# Altium schematic sheet SCH-RP2350zero.schdoc
size 394 x 316 mm
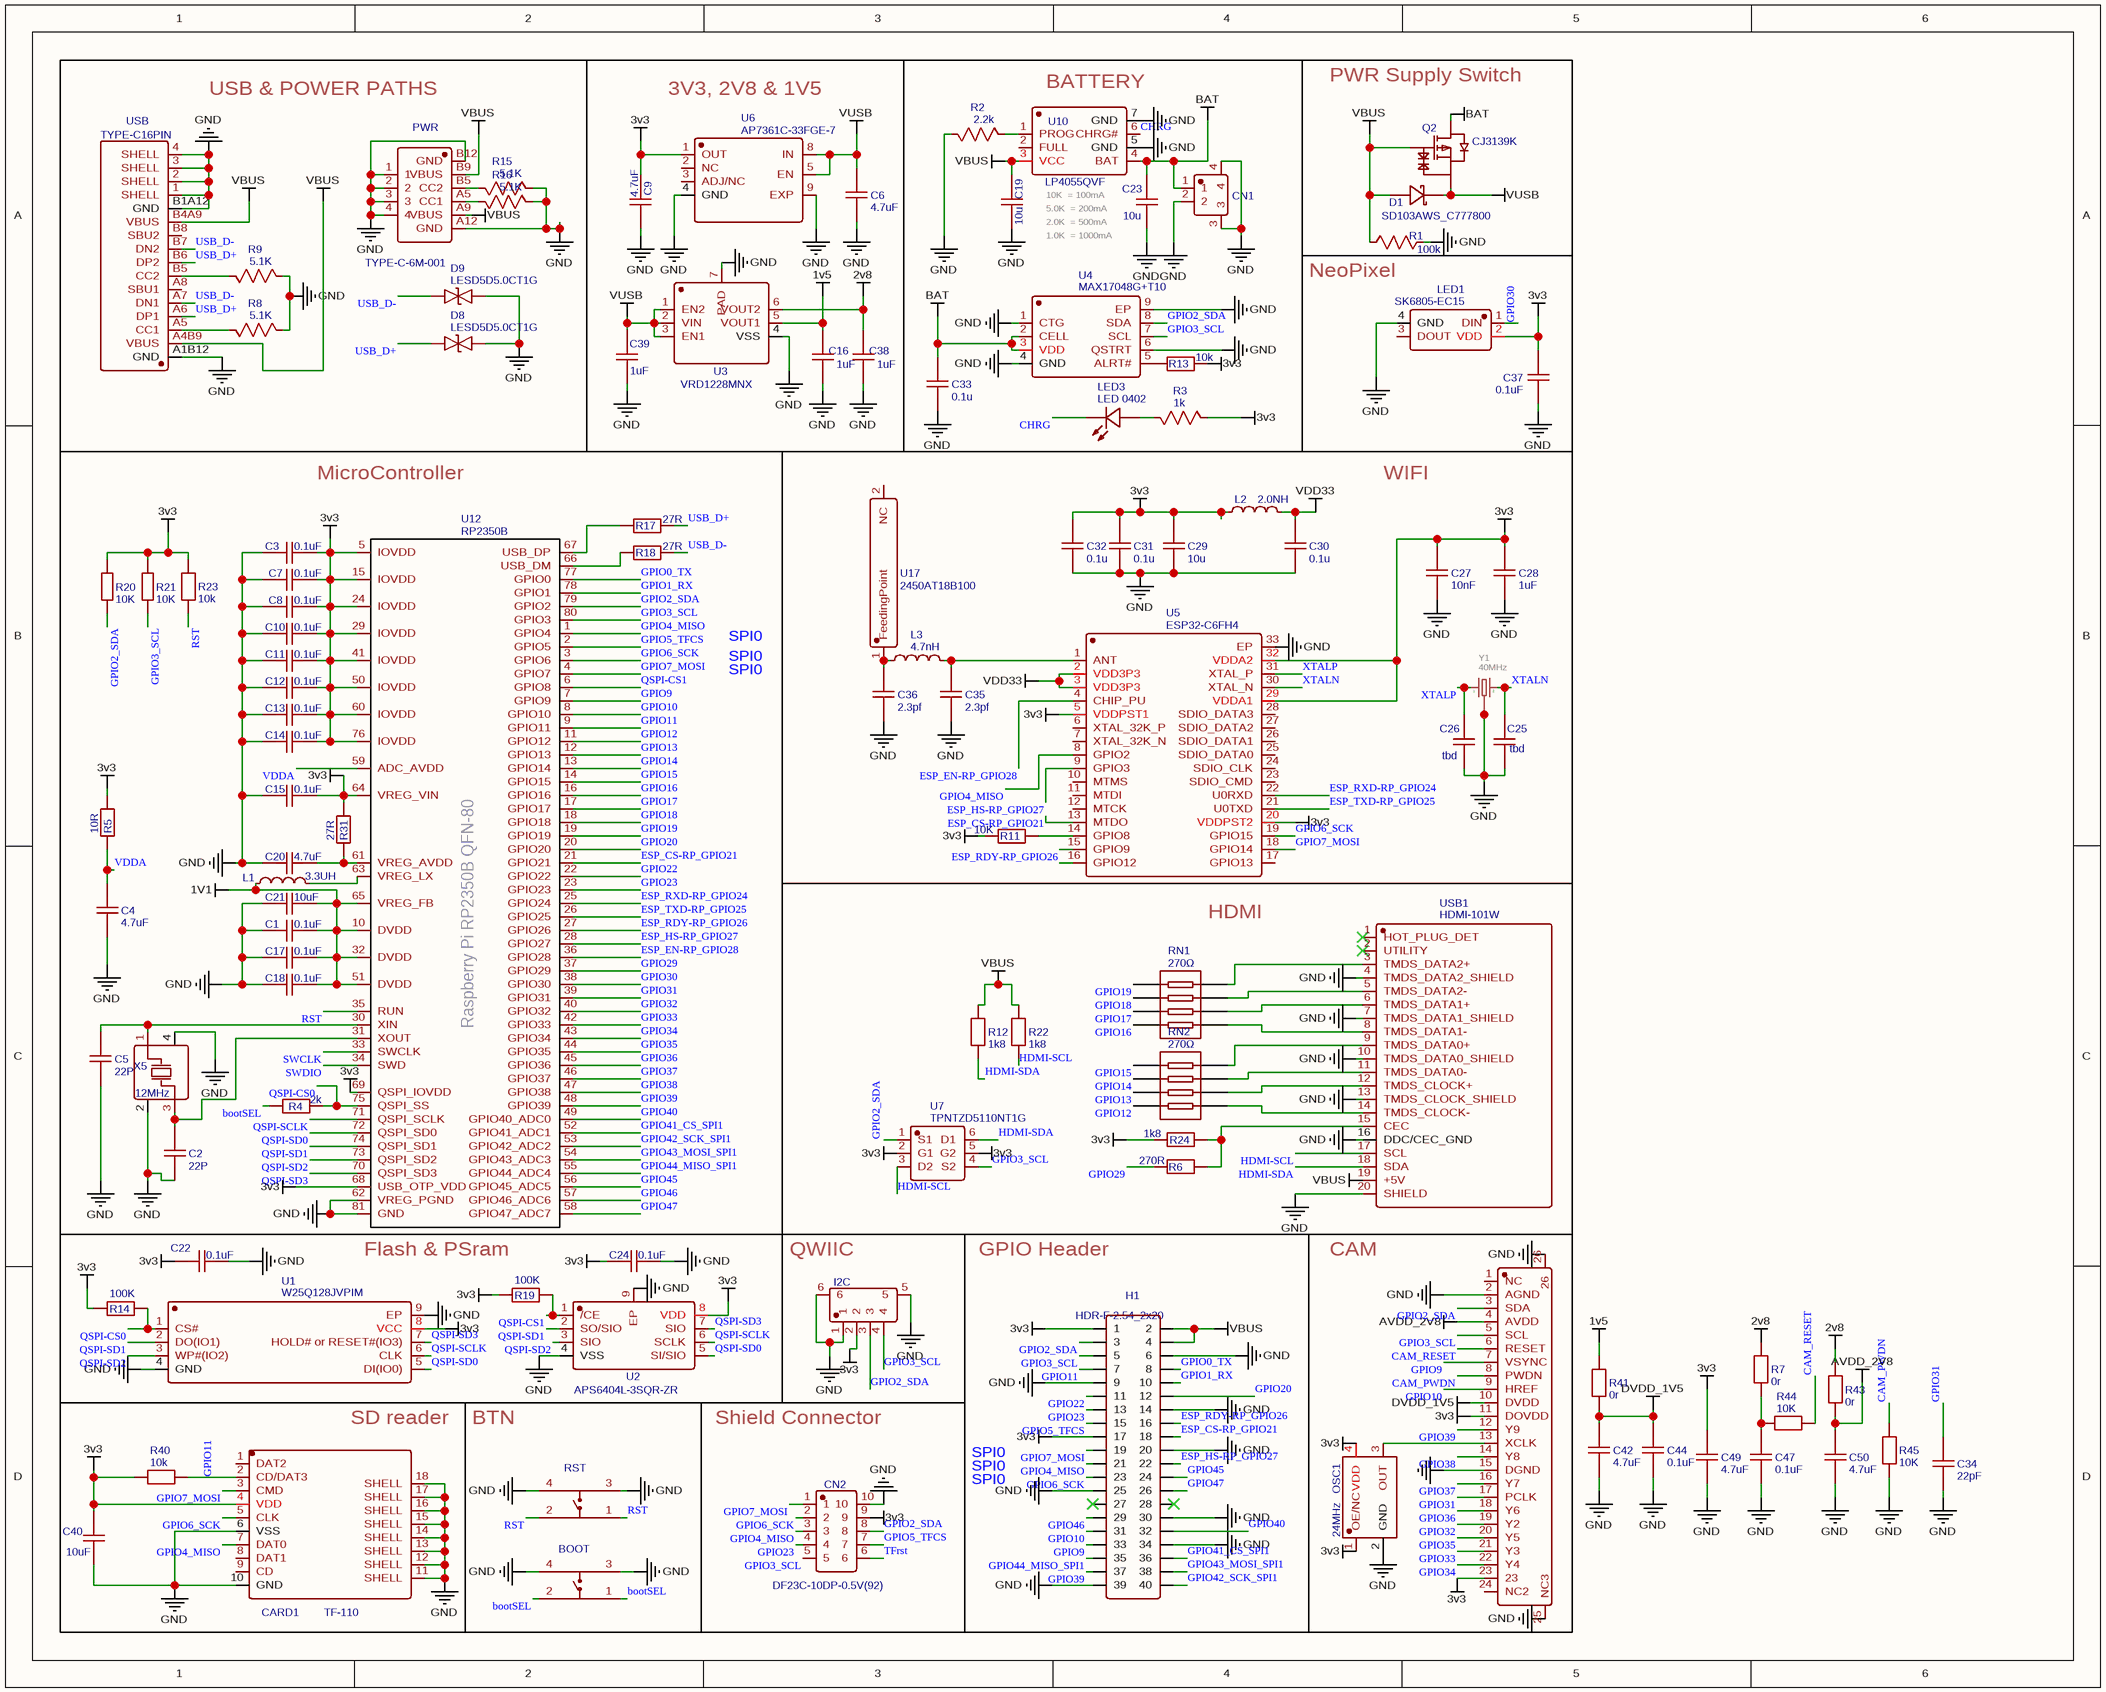
[diagram p0: SCH-RP2350zero.schdoc]

## Parts
BOOT  GT-TC034F-H018-L1  [SW-SMD_GT-TC034F-H018-L1]  (value not drawn)
C1  0.1uF  [C0402]
C2  22P  [C0402]
C3  0.1uF  [C0402]
C4  4.7uF  [C0402]
C5  22P  [C0402]
C6  4.7uF  [C0603]
C7  0.1uF  [C0402]
C8  0.1uF  [C0402]
C9  4.7uF  [C0603]
C10  0.1uF  [C0402]
C11  0.1uF  [C0402]
C12  0.1uF  [C0402]
C13  0.1uF  [C0402]
C14  0.1uF  [C0402]
C15  0.1uF  [C0402]
C16  1uF  [C0402]
C17  0.1uF  [C0402]
C18  0.1uF  [C0402]
C19  10u  [C0402]
C20  4.7uF  [C0402]
C21  10uF  [C0402]
C22  0.1uF  [C0402]
C23  10u  [C0402]
C24  0.1uF  [C0402]
C25  tbd  [C0402]
C26  tbd  [C0402]
C27  10nF  [C0402]
C28  1uF  [C0402]
C29  10u  [C0402]
C30  0.1u  [C0402]
C31  0.1u  [C0402]
C32  0.1u  [C0402]
C33  0.1u  [C0402]
C34  22pF  [C0402]
C35  2.3pf  [C0402]
C36  2.3pf  [C0402]
C37  0.1uF  [C0402]
C38  1uF  [C0402]
C39  1uF  [C0402]
C40  10uF  [C0402]
C42  4.7uF  [C0402]
C44  0.1uF  [C0402]
C47  0.1uF  [C0402]
C49  4.7uF  [C0402]
C50  4.7uF  [C0402]
CAMERA1  FPC0.5-24P  [FPC-SMD_P0.50-24P_XJ-FGS]  (value not drawn)
CARD1  TF-110  [TF-SMD_TF-110]
CN1  WF08002-01205  [CONN-SMD_WF08002-01205]  (value not drawn)
CN2  DF23C-10DP-0.5V(92)  [CONN-SMD_DF23C-10DP-0.5V92]
D1  SD103AWS_C777800  [SOD-323_L1.8-W1.3-LS2.5-FD]
D8  LESD5D5.0CT1G  [SOD-523_L1.2-W0.8-LS1.6-BI]
D9  LESD5D5.0CT1G  [SOD-523_L1.2-W0.8-LS1.6-BI]
H1  HDR-F-2.54_2x20  [HDR-F-2.54_2X20]
I2C  WF10004-01200  [CONN-SMD_4P-P1.00_WF10004-01200]  (value not drawn)
L1  3.3UH  [L0603]
L2  2.0NH  [L0402]
L3  4.7nH  [L0402]
LED1  SK6805-EC15  [LED-SMD_4P-L1.5-W1.5-BL]
LED3  LED 0402  [LED_0402]
OSC1  24MHz  [OSC-SMD_4P-L1.6-W1.2-BL]
PWR  TYPE-C-6M-001  [USB-C-SMD_918-418K2023S40006]
Q2  CJ3139K  [SOT-723_L1.2-W0.8-P0.40-LS1.2-BR]
R1  100k  [R0402]
R2  2.2k  [R0402]
R3  1k  [R0402]
R4  2k  [R0402]
R5  10R  [R0402]
R6  270R  [R0402]
R7  0r  [R0402]
R8  5.1K  [R0402]
R9  5.1K  [R0402]
R11  10K  [R0402]
R12  1k8  [R0402]
R13  10k  [R0402]
R14  100K  [R0402]
R15  5.1K  [R0402]
R16  5.1K  [R0402]
R17  27R  [R0402]
R18  27R  [R0402]
R19  100K  [R0402]
R20  10K  [R0402]
R21  10K  [R0402]
R22  1k8  [R0402]
R23  10k  [R0402]
R24  1k8  [R0402]
R31  27R  [R0402]
R40  10k  [R0402]
R41  0r  [R0402]
R43  0r  [R0402]
R44  10K  [R0402]
R45  10K  [R0402]
RN1  270Ω  [RES-ARRAY-SMD_0804-8P-L2.0-W1.0-BL]
RN2  270Ω  [RES-ARRAY-SMD_0804-8P-L2.0-W1.0-BL]
RST  GT-TC034F-H018-L1  [SW-SMD_GT-TC034F-H018-L1]  (value not drawn)
U1  W25Q128JVPIM  [WSON-8_L5.0-W6.0-P1.27-BL-EP]
U2  APS6404L-3SQR-ZR  [USON-8_L3.0-W2.0-P0.50-BL-EP]
U3  VRD1228MNX  [SON-6_L1.8-W1.8-P0.50-LS2.0-BL]
U4  MAX17048G+T10  [DFN-8_L2.0-W2.0-P0.50-BL-EP]
U5  ESP32-C6FH4  [QFN-32_L5.0-W5.0-P0.50-TL-EP3.4]
U6  AP7361C-33FGE-7  [DFN-8_L3.0-W3.0-P0.65-BL-EP]
U7  TPNTZD5110NT1G  [SOT-563-6_L1.6-W1.2-P0.5-LS1.6-BR]
U10  LP4055QVF  [TDFN-6_L2.0-W2.0-P0.65-TL-EP]
U12  RP2350B  [RP2350B_QFN-80]
U17  2450AT18B100  [ANT-SMD_L3.2-W1.6]
USB  TYPE-C16PIN  [USB-C-SMD_TYPE-C16PIN]
USB1  HDMI-101W  [HDMI-SMD_HDMI-101W]
X5  12MHz  [OSC-SMD_4P-L2.0-W1.6-BL_R2016XXXXMD4GI]
Y1  40MHz  [OSC-SMD_4P-L2.0-W1.6-BL]

## Nets
1V1: C1.2 C17.2 C18.2 C21.2 L1.1 U12.10(DVDD) U12.32(DVDD) U12.51(DVDD) U12.65(VREG_FB)
1v5: C16.2 R41.1 U3.5(VOUT1)
2v8: C38.2 R7.1 R43.1 U3.6(VOUT2)
3v3: C3.2 C7.2 C8.2 C9.2 C10.2 C11.2 C12.2 C13.2 C14.2 C15.2 C22.1 C24.1 C27.2 C28.2 C29.1 C31.1 C32.1 C37.1 C40.1 C49.1 CAMERA1.11(DOVDD) CAMERA1.23 CARD1.4(VDD) CN2.9 H1.1 H1.17 I2C.2 L2.1 LED1.2(VDD) OSC1.1(OE/NC) OSC1.4(VDD) R3.2 R5.2 R11.1 R13.2 R14.1 R19.1 R20.1 R21.1 R23.1 R24.2 R31.2 R40.2 U1.8(VCC) U2.8(VDD) U5.5(VDDPST1) U5.20(VDDPST2) U5.29(VDDA1) U5.32(VDDA2) U6.1(OUT) U7.2(G1) U7.5(G2) U12.5(IOVDD) U12.15(IOVDD) U12.24(IOVDD) U12.29(IOVDD) U12.41(IOVDD) U12.50(IOVDD) U12.60(IOVDD) U12.64(VREG_VIN) U12.68(USB_OTP_VDD) U12.69(QSPI_IOVDD) U12.76(IOVDD)
AVDD_2V8: C50.1 CAMERA1.4(AVDD) R43.2
BAT: C23.1 C33.2 CN1.1 Q2.3(D) U4.2(CELL) U4.3(VDD) U10.4(BAT)
DVDD_1V5: C42.1 C44.1 CAMERA1.10(DVDD) R41.2
GND: BOOT.3 BOOT.4 C1.1 C2.2 C3.1 C4.1 C5.2 C6.2 C7.1 C8.1 C9.1 C10.1 C11.1 C12.1 C13.1 C14.1 C15.1 C16.1 C17.1 C18.1 C19.2 C20.1 C21.1 C22.2 C23.2 C24.2 C25.2 C26.2 C27.1 C28.1 C29.2 C30.2 C31.2 C32.2 C33.1 C34.2 C35.1 C36.1 C37.2 C38.1 C39.1 C40.2 C42.2 C44.2 C47.2 C49.2 C50.2 CAMERA1.2(AGND) CAMERA1.15(DGND) CAMERA1.25(NC3) CAMERA1.26 CARD1.6(VSS) CARD1.10(GND) CARD1.11(SHELL) CARD1.12(SHELL) CARD1.13(SHELL) CARD1.14(SHELL) CARD1.15(SHELL) CARD1.16(SHELL) CARD1.17(SHELL) CARD1.18(SHELL) CN1.2 CN1.3 CN1.4 CN2.10 D8.2 D9.2 H1.6 H1.9 H1.14 H1.20 H1.25 H1.30 H1.34 H1.39 I2C.1 I2C.5 I2C.6 LED1.4(GND) OSC1.2(GND) PWR.1 PWR.2 PWR.3 PWR.4 PWR.A12(GND) PWR.B12(GND) R1.1 R2.2 R8.1 R9.1 R15.1 R16.1 R45.1 RST.3 RST.4 U1.4(GND) U1.9(EP) U2.4(VSS) U2.9(EP) U3.4(VSS) U3.7(PAD) U4.1(CTG) U4.4(GND) U4.6(QSTRT) U4.9(EP) U5.33(EP) U6.4(GND) U6.9(EXP) U10.5(GND) U10.7(GND) U12.62(VREG_PGND) U12.81(GND) USB.1(SHELL) USB.2(SHELL) USB.3(SHELL) USB.4(SHELL) USB.A1B12(GND) USB.B1A12(GND) USB1.4(TMDS_DATA2_SHIELD) USB1.7(TMDS_DATA1_SHIELD) USB1.10(TMDS_DATA0_SHIELD) USB1.13(TMDS_CLOCK_SHIELD) USB1.16(DDC/CEC_GND) USB1.20(SHIELD) X5.2(GND/Lid) X5.4(GND/Lid) Y1.2(GND) Y1.4(GND)
VBUS: C19.1 D1.1(A) H1.2 H1.4 PWR.A9(VBUS) PWR.B9(VBUS) Q2.1(G) R1.2 R12.1 R22.1 U10.3(VCC) USB.A4B9(VBUS) USB.B4A9(VBUS) USB1.19(+5V)
VDD33: C30.1 L2.2 U5.2(VDD3P3) U5.3(VDD3P3)
VUSB: C6.1 C39.2 D1.2(K) Q2.2(S) U3.1(EN2) U3.2(VIN) U3.3(EN1) U6.5(EN) U6.8(IN)
bootSEL: BOOT.1 BOOT.2 R4.1
CAM_PWDN: CAMERA1.8(PWDN) R45.2
CAM_RESET: CAMERA1.6(RESET) R44.1
CHRG: LED3.2(K) U10.6(CHRG#)
ESP_CS-RP_GPIO21: H1.18 U5.13(MTDO) U12.21(GPIO21)
ESP_EN-RP_GPIO28: U5.4(CHIP_PU) U12.36(GPIO28)
ESP_HS-RP_GPIO27: H1.22 U5.9(GPIO3) U12.28(GPIO27)
ESP_RDY-RP_GPIO26: H1.16 U5.15(GPIO9) U12.27(GPIO26)
ESP_RXD-RP_GPIO24: U5.22(U0RXD) U12.25(GPIO24)
ESP_TXD-RP_GPIO25: U5.21(U0TXD) U12.26(GPIO25)
GPIO0_TX: H1.8 U12.77(GPIO0)
GPIO1_RX: H1.10 U12.78(GPIO1)
GPIO2_SDA: CAMERA1.3(SDA) CN2.8 H1.3 I2C.3 R20.2 U4.8(SDA) U7.1(S1) U12.79(GPIO2)
GPIO3_SCL: CAMERA1.5(SCL) CN2.5 H1.5 I2C.4 R21.2 U4.7(SCL) U7.4(S2) U12.80(GPIO3)
GPIO4_MISO: CARD1.7(DAT0) CN2.3 H1.21 U5.8(GPIO2) U12.1(GPIO4)
GPIO5_TFCS: CN2.7 H1.15 U12.2(GPIO5)
GPIO6_SCK: CARD1.5(CLK) CN2.2 H1.23 U5.19(GPIO15) U12.3(GPIO6)
GPIO7_MOSI: CARD1.3(CMD) CN2.1 H1.19 U5.18(GPIO14) U12.4(GPIO7)
GPIO9: CAMERA1.7(VSYNC) H1.33 U12.7(GPIO9)
GPIO10: CAMERA1.9(HREF) H1.31 U12.8(GPIO10)
GPIO11: CARD1.2(CD/DAT3) H1.7 R40.1 U12.9(GPIO11)
GPIO12: RN2.8 U12.11(GPIO12)
GPIO13: RN2.7 U12.12(GPIO13)
GPIO14: RN2.6 U12.13(GPIO14)
GPIO15: RN2.5 U12.14(GPIO15)
GPIO16: RN1.8 U12.16(GPIO16)
GPIO17: RN1.7 U12.17(GPIO17)
GPIO18: RN1.6 U12.18(GPIO18)
GPIO19: RN1.5 U12.19(GPIO19)
GPIO20: H1.12 U12.20(GPIO20)
GPIO22: H1.11 U12.22(GPIO22)
GPIO23: CN2.4 H1.13 U12.23(GPIO23)
GPIO29: R6.1 U12.37(GPIO29)
GPIO30: LED1.1(DIN) U12.38(GPIO30)
GPIO31: C34.1 CAMERA1.17(PCLK) U12.39(GPIO31)
GPIO32: CAMERA1.19(Y2) U12.40(GPIO32)
GPIO33: CAMERA1.21(Y3) U12.42(GPIO33)
GPIO34: CAMERA1.22(Y4) U12.43(GPIO34)
GPIO35: CAMERA1.20(Y5) U12.44(GPIO35)
GPIO36: CAMERA1.18(Y6) U12.45(GPIO36)
GPIO37: CAMERA1.16(Y7) U12.46(GPIO37)
GPIO38: CAMERA1.14(Y8) U12.47(GPIO38)
GPIO39: CAMERA1.12(Y9) H1.37 U12.48(GPIO39)
GPIO40: H1.32 U12.49(GPIO40_ADC0)
GPIO41_CS_SPI1: H1.36 U12.52(GPIO41_ADC1)
GPIO42_SCK_SPI1: H1.40 U12.53(GPIO42_ADC2)
GPIO43_MOSI_SPI1: H1.38 U12.54(GPIO43_ADC3)
GPIO44_MISO_SPI1: H1.35 U12.55(GPIO44_ADC4)
GPIO45: H1.24 U12.56(GPIO45_ADC5)
GPIO46: H1.29 U12.57(GPIO46_ADC6)
GPIO47: H1.26 U12.58(GPIO47_ADC7)
HDMI-SCL: R22.2 U7.3(D2) USB1.17(SCL)
HDMI-SDA: R12.2 U7.6(D1) USB1.18(SDA)
QSPI-CS0: R4.2 R14.2 U1.1(CS#) U12.75(QSPI_SS)
QSPI-CS1: R19.2 U2.1(/CE) U12.6(GPIO8)
QSPI-SCLK: U1.6(CLK) U2.6(SCLK) U12.71(QSPI_SCLK)
QSPI-SD0: U1.5(DI(IO0)) U2.5(SI/SIO) U12.72(QSPI_SD0)
QSPI-SD1: U1.2(DO(IO1)) U2.2(SO/SIO) U12.74(QSPI_SD1)
QSPI-SD2: U1.3(WP#(IO2)) U2.3(SIO) U12.73(QSPI_SD2)
QSPI-SD3: U1.7(HOLD#_or_RESET#(IO3)) U2.7(SIO) U12.70(QSPI_SD3)
RST: R23.2 RST.1 RST.2 U12.35(RUN)
SWCLK: U12.33(SWCLK)
SWDIO: U12.34(SWD)
TFrst: CN2.6
USB_D+: D8.1 R17.2 USB.A6(DP1) USB.B6(DP2)
USB_D-: D9.1 R18.2 USB.A7(DN1) USB.B7(DN2)
VDDA: C4.2 R5.1 U12.59(ADC_AVDD)
XTALN: C25.1 U5.30(XTAL_N) Y1.3
XTALP: C26.1 U5.31(XTAL_P) Y1.1
NetC2_1: C2.1 U12.31(XOUT) X5.3(OSC2)
NetC5_1: C5.1 U12.30(XIN) X5.1(OSC1)
NetC20_2: C20.2 R31.1 U12.61(VREG_AVDD)
NetC35_2: C35.2 L3.2 U5.1(ANT)
NetC36_2: C36.2 L3.1 U17.1(FeedingPoint)
NetC47_1: C47.1 R7.2 R44.2
NetCAMERA1_13: CAMERA1.13(XCLK) OSC1.3(OUT)
NetL1_2: L1.2 U12.63(VREG_LX)
NetLED3_1: LED3.1(A) R3.1
NetPWR_A5: PWR.A5(CC1) R16.2
NetPWR_B5: PWR.B5(CC2) R15.2
NetR2_1: R2.1 U10.1(PROG)
NetR6_2: R6.2 R24.1 USB1.15(CEC)
NetR8_2: R8.2 USB.A5(CC1)
NetR9_2: R9.2 USB.B5(CC2)
NetR11_2: R11.2 U5.14(GPIO8)
NetR13_1: R13.1 U4.5(ALRT#)
NetR17_1: R17.1 U12.67(USB_DP)
NetR18_1: R18.1 U12.66(USB_DM)
NetRN1_1: RN1.1 USB1.8(TMDS_DATA1-)
NetRN1_2: RN1.2 USB1.6(TMDS_DATA1+)
NetRN1_3: RN1.3 USB1.5(TMDS_DATA2-)
NetRN1_4: RN1.4 USB1.3(TMDS_DATA2+)
NetRN2_1: RN2.1 USB1.14(TMDS_CLOCK-)
NetRN2_2: RN2.2 USB1.12(TMDS_CLOCK+)
NetRN2_3: RN2.3 USB1.11(TMDS_DATA0-)
NetRN2_4: RN2.4 USB1.9(TMDS_DATA0+)

Not connected (* = marked no-connect by the designer): CAMERA1 1(NC) 24(NC2); CARD1 1(DAT2) 8(DAT1) 9(CD); H1 27* 28*; LED1 3(DOUT); U5 6(XTAL_32K_P) 7(XTAL_32K_N) 10(MTMS) 11(MTDI) 12(MTCK) 16(GPIO12) 17(GPIO13) 23(SDIO_CMD) 24(SDIO_CLK) 25(SDIO_DATA0) 26(SDIO_DATA1) 27(SDIO_DATA2) 28(SDIO_DATA3); U6 2(NC) 3(ADJ/NC); U10 2(FULL); U17 2(NC); USB A8(SBU1) B8(SBU2); USB1 1(HOT_PLUG_DET)* 2(UTILITY)*

## Notes on the sheet
- USB & POWER PATHS
- 3V3, 2V8 & 1V5
- (near U10) BATTERY
- (near Q2) PWR Supply Switch
- 2.0K  = 500mA
- 5.0K  = 200mA
- 10K  = 100mA
- 1.0K  = 1000mA
- (near R1) NeoPixel
- MicroController
- WIFI
- SPI0
- HDMI
- Flash & PSram
- (near I2C) QWIIC
- GPIO Header
- (near USB1) CAM
- SD reader
- BTN
- Shield Connector
- (in symbol RP2350B) Raspberry Pi RP2350B QFN-80

## Library data of the parts
BOOT RST = GT-TC034F-H018-L1: Manufacturer: G-Switch(品赞); Contributor: LCSC; Supplier: LCSC; Supplier Part: C2835023; Manufacturer Part: GT-TC034F-H018-L1; spicePre: S; spiceSymbolName: GT-TC034F-H018-L1
C1 C3 C7 C8 C10-C15 C17 C18 C22 C24 C37 C44 C47 = 0.1uF: nameAlias: Value(F); Contributor: LCEDA_Lib; spicePre: C; spiceSymbolName: C_0805_US
C2 C5 = 22P: nameAlias: Value(F); Contributor: LCEDA_Lib; spicePre: C; spiceSymbolName: C_0805_US
C4 C6 C9 C20 C42 C49 C50 = 4.7uF: nameAlias: Value(F); Contributor: LCEDA_Lib; spicePre: C
  C4 C20 C42 C49 C50: spiceSymbolName: C_0805_US
  C6 C9: spiceSymbolName: C_0603_US
C16 C28 C38 C39 = 1uF: nameAlias: Value(F); Contributor: LCEDA_Lib; spicePre: C; spiceSymbolName: C_0805_US
C19 C23 C29 = 10u: nameAlias: Value(F); Contributor: LCEDA_Lib; spicePre: C; spiceSymbolName: C_0805_US
C21 C40 = 10uF: nameAlias: Value(F); Contributor: LCEDA_Lib; spicePre: C; spiceSymbolName: C_0805_US
C25 C26 = tbd: nameAlias: Value(F); Contributor: LCEDA_Lib; spicePre: C; spiceSymbolName: C_0805_US
C27 = 10nF: nameAlias: Value(F); Contributor: LCEDA_Lib; spicePre: C; spiceSymbolName: C_0805_US
C30-C33 = 0.1u: nameAlias: Value(F); Contributor: LCEDA_Lib; spicePre: C; spiceSymbolName: C_0805_US
C34 = 22pF: nameAlias: Value(F); Contributor: LCEDA_Lib; spicePre: C; spiceSymbolName: C_0805_US
C35 C36 = 2.3pf: nameAlias: Value(F); Contributor: LCEDA_Lib; spicePre: C; spiceSymbolName: C_0805_US
CAMERA1 = FPC0.5-24P: Manufacturer: Shenzhen Cankemeng; Contributor: LCSC; Supplier: LCSC; Supplier Part: C132514; Manufacturer Part: -; JLCPCB Part Class: Extended Part; spicePre: F; spiceSymbolName: FPC0.5-24P
CARD1 = TF-110: Manufacturer: XUNPU; Contributor: LCSC; Supplier: LCSC; Supplier Part: C266613; Manufacturer Part: TF-110; JLCPCB Part Class: Extended Part; spicePre: C; spiceSymbolName: TF-110
CN1 = WF08002-01205: Manufacturer: SHENZHEN ATOM TECH; Contributor: LCSC; Supplier: LCSC; Supplier Part: C545257; Manufacturer Part: WF08002-01205; JLCPCB Part Class: Extended Part; spicePre: C; spiceSymbolName: WF08002-01205
CN2 = DF23C-10DP-0.5V(92): Manufacturer: HRS(广濑); Contributor: LCSC; Supplier: LCSC; Supplier Part: C530956; Manufacturer Part: DF23C-10DP-0.5V(92); JLCPCB Part Class: Extended Part; spicePre: C; spiceSymbolName: DF23C-10DP-0.5V(92)
D1 = SD103AWS_C777800: Manufacturer: HT(Shenzhen Jinyu Semicon); Contributor: LCSC; Supplier: LCSC; Supplier Part: C777800; Manufacturer Part: SD103AWS; JLCPCB Part Class: Extended Part; spicePre: D; spiceSymbolName: SD103AWS_C777800
D8 D9 = LESD5D5.0CT1G: Manufacturer: Leshan Radio; Contributor: LCSC; Supplier: LCSC; Supplier Part: C383211; Manufacturer Part: LESD5D5.0CT1G; JLCPCB Part Class: Extended Part; spicePre: D; spiceSymbolName: LESD5D5.0CT1G
H1 = HDR-F-2.54_2x20: Contributor: LCEDA_Lib; Supplier Part: C50982; Supplier: LCSC; spicePre: H; spiceSymbolName: HDR-F-2.54_2x20
I2C = WF10004-01200: Manufacturer: ATOM(爱特姆); Contributor: LCSC; Supplier: LCSC; Supplier Part: C479990; Manufacturer Part: WF10004-01200; JLCPCB Part Class: Extended Part; spicePre: C; spiceSymbolName: WF10004-01200
L1 = 3.3UH: nameAlias: Value(H); Contributor: LCEDA_Lib; spicePre: L; spiceSymbolName: L0603_US
L2 = 2.0NH: nameAlias: Value(H); Contributor: LCEDA_Lib; spicePre: L; spiceSymbolName: L0402_US
L3 = 4.7nH: nameAlias: Value(H); Contributor: LCEDA_Lib; spicePre: L; spiceSymbolName: L0402_US
LED1 = SK6805-EC15: Manufacturer: 欧思科光电; Contributor: LCSC; Supplier: LCSC; Supplier Part: C2890035; Manufacturer Part: SK6805-EC15; JLCPCB Part Class: Extended Part; spicePre: L; spiceSymbolName: SK6805-EC15
LED3 = LED 0402: Manufacturer: ROHM Semicon; Manufacturer Part: SML-P12YTT86Q; Contributor: LCSC; Supplier: LCSC; Supplier Part: C123071; spicePre: L; spiceSymbolName: LED 0402
OSC1 = 24MHz: Manufacturer: YXC(扬兴晶振); Manufacturer Part: OT4EL89CJI-111YLC-24M; nameAlias: Value; Contributor: lcsc; Supplier: LCSC; Supplier Part: C19078199; JLCPCB Part Class: Extended Part; spicePre: O; spiceSymbolName: OT4EL89CJI-111YLC-24M
PWR = TYPE-C-6M-001: Manufacturer: USAKRO(美韩); Contributor: LCSC; Supplier: LCSC; Supplier Part: C2798175; Manufacturer Part: TYPE-C-6M-001; JLCPCB Part Class: Extended Part; spicePre: U; spiceSymbolName: TYPE-C-6M-001
Q2 = CJ3139K: Manufacturer: CJ; SMT Type: Extend; Paste Type: expand; Supplier: LCSC; Manufacturer Part: CJ3139K; image: //image.lceda.cn/szlcsc/C70022.jpg; Supplier Part: C70022; JLCPCB SMD: Yes; Assembly Type: smtWeld; spicePre: Q; spiceSymbolName: CJ3139K
R1 = 100k: nameAlias: Value(Ω); Contributor: LCEDA_Lib; spicePre: R; spiceSymbolName: R_0805_US
R2 = 2.2k: nameAlias: Value(Ω); Contributor: LCEDA_Lib; spicePre: R; spiceSymbolName: R_0603_US
R3 = 1k: nameAlias: Value(Ω); Contributor: LCEDA_Lib; spicePre: R; spiceSymbolName: R_0603_US
R4 = 2k: nameAlias: Value(Ω); Contributor: LCEDA_Lib; spicePre: R; spiceSymbolName: R_0402_EU
R5 = 10R: nameAlias: Value(Ω); Contributor: LCEDA_Lib; spicePre: R; spiceSymbolName: R_0603_EU
R6 = 270R: nameAlias: Value(Ω); Contributor: LCEDA_Lib; spicePre: R; spiceSymbolName: R_0603_EU
R7 R41 R43 = 0r: nameAlias: Value(Ω); Contributor: LCEDA_Lib; spicePre: R; spiceSymbolName: R_0402_EU
R8 R9 R15 R16 = 5.1K: nameAlias: Value(Ω); Contributor: LCEDA_Lib; spicePre: R; spiceSymbolName: R_0603_US
R11 R44 R45 = 10K: nameAlias: Value(Ω); Contributor: LCEDA_Lib; spicePre: R
  R11: spiceSymbolName: R_0603_EU
  R44 R45: spiceSymbolName: R_0402_EU
R12 R22 R24 = 1k8: nameAlias: Value(Ω); Contributor: LCEDA_Lib; spicePre: R; spiceSymbolName: R_0603_EU
R13 R23 R40 = 10k: nameAlias: Value(Ω); Contributor: LCEDA_Lib; spicePre: R
  R13: spiceSymbolName: R_0603_EU
  R23 R40: spiceSymbolName: R_0402_EU
R14 R19 = 100K: nameAlias: Value(Ω); Contributor: LCEDA_Lib; spicePre: R; spiceSymbolName: R_0402_EU
R17 R18 R31 = 27R: nameAlias: Value(Ω); Contributor: LCEDA_Lib; spicePre: R; spiceSymbolName: R_0603_EU
R20 R21 = 10K: Manufacturer: YAGEO; Manufacturer Part: RC0603FR-0739KL; nameAlias: Resistance (Ohms); Contributor: LCSC; Supplier: LCSC; Supplier Part: C163424; spicePre: R; spiceSymbolName: RC0603FR-0739KL
RN1 RN2 = 270Ω: Manufacturer: BOURNS; Manufacturer Part: CAT10-271J4LF; nameAlias: Value; Contributor: LCSC; Supplier: LCSC; Supplier Part: C148510; JLCPCB Part Class: Extended Part; spicePre: R; spiceSymbolName: CAT10-271J4LF
U1 = W25Q128JVPIM: Manufacturer: WINBOND(华邦); Contributor: LCSC; Supplier: LCSC; Supplier Part: C2641199; Manufacturer Part: W25Q128JVPIM; spicePre: U; spiceSymbolName: W25Q128JVPIM
U2 = APS6404L-3SQR-ZR: Manufacturer: Apmemory; Contributor: lcsc; Supplier: LCSC; Supplier Part: C3040877; Manufacturer Part: APS6404L-3SQR-ZR; JLCPCB Part Class: Extended Part; spicePre: U; spiceSymbolName: APS6404L-3SQR-ZR
U3 = VRD1228MNX: Manufacturer: AnaSem; Contributor: LCSC; Supplier: LCSC; Supplier Part: C697900; Manufacturer Part: VRD1228MNX; JLCPCB Part Class: Extended Part; spicePre: U; spiceSymbolName: VRD1228MNX
U4 = MAX17048G+T10: Manufacturer: ADI(亚德诺)/MAXIM(美信); Contributor: LCSC; Supplier: LCSC; Supplier Part: C2682616; Manufacturer Part: MAX17048G+T10; JLCPCB Part Class: Extended Part; spicePre: U; spiceSymbolName: MAX17048G+T10
U5 = ESP32-C6FH4: Manufacturer: null; Contributor: lcsc; Supplier: LCSC; Supplier Part: C9900054998; Manufacturer Part: ESP32-C6FH4; spicePre: U; spiceSymbolName: ESP32-C6FH4
U6 = AP7361C-33FGE-7: Manufacturer: DIODES; Contributor: Hany_elkomy; SMT Type: Extend; Paste Type: expand; Supplier: LCSC; Manufacturer Part: AP7361C-33FGE-7; Supplier Part: C151007; JLCPCB SMD: Yes; LCSC Assembly: Yes; Assembly Type: smtWeld; spicePre: U; spiceSymbolName: AP7361C-33FGE-7
U7 = TPNTZD5110NT1G: Manufacturer: TECH PUBLIC(台舟); Contributor: lcsc; Supplier: LCSC; Supplier Part: C5310957; Manufacturer Part: TPNTZD5110NT1G; JLCPCB Part Class: Extended Part; spicePre: U; spiceSymbolName: TPNTZD5110NT1G
U10 = LP4055QVF: Manufacturer: LOWPOWER; Contributor: LCSC; SMT Type: Extend; Supplier: LCSC; Supplier Part: C387714; Manufacturer Part: LP4055QVF; LCSC Assembly: Yes; spicePre: U; spiceSymbolName: LP4055QVF
U12 = RP2350B: Manufacturer: Raspberry Pi; Contributor: Hany_elkomy; Manufacturer Part: RP2350B; link: https://datasheets.raspberrypi.com/rp2350/rp2350-datasheet.pdf; spicePre: U; spiceSymbolName: RP2350B
U17 = 2450AT18B100: Manufacturer: null; Contributor: LCSC; Supplier: LCSC; Supplier Part: C2836414; Manufacturer Part: 2450AT18B100; JLCPCB Part Class: Extended Part; spicePre: U; spiceSymbolName: 2450AT18B100
USB = TYPE-C16PIN: Manufacturer: SHOU HAN; Contributor: LCSC; Supplier: LCSC; Supplier Part: C393939; Manufacturer Part: TYPE-C16PIN; spicePre: U; spiceSymbolName: TYPE-C16PIN
USB1 = HDMI-101W: Manufacturer: XUNPU(讯普); Contributor: LCSC; Supplier: LCSC; Supplier Part: C720619; Manufacturer Part: HDMI-101W; JLCPCB Part Class: Extended Part; spicePre: U; spiceSymbolName: HDMI-101W
X5 = 12MHz: Manufacturer: Murata; Manufacturer Part: CSACM12M0G530000R0; nameAlias: Frequency; Contributor: LCSC; Supplier: Taobao; Supplier Part: https://item.taobao.com/item.htm?spm=a230r.1.14.83.535b5317fkOwx3&id=520129795732&ns=1&abbucket=4#detail; spicePre: X; spiceSymbolName: X2B012000B91H-U